# EAGLE design LedBoard (EAGLE 6.2)
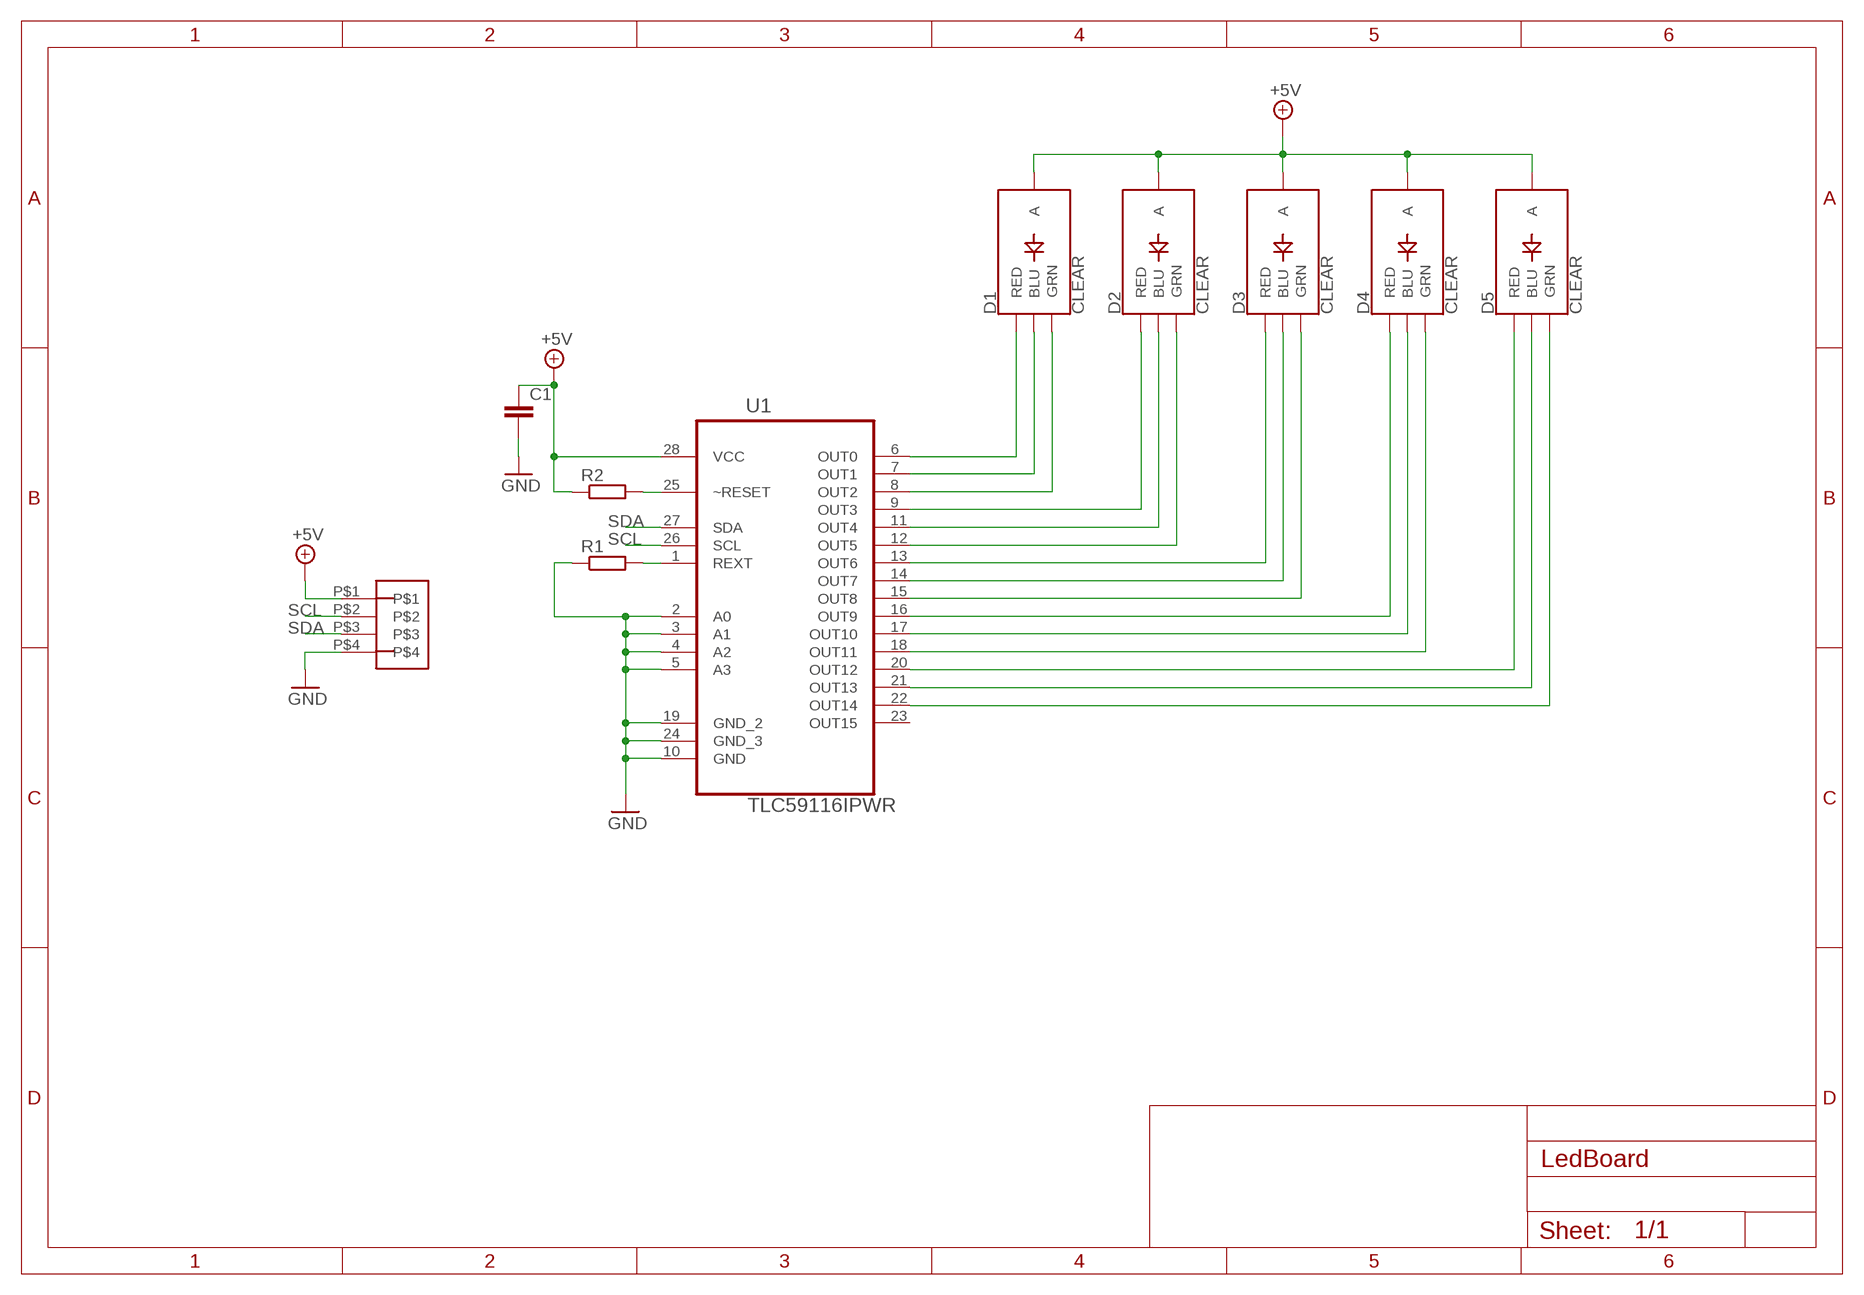
[diagram p0: schematic, sheet 1]

## Parts
C1  C-EUC0603  [C0603]
D1  CLEAR  LED-RGB-CACLEAR  [LED-RGB-THRU]
D2  CLEAR  LED-RGB-CACLEAR  [LED-RGB-THRU]
D3  CLEAR  LED-RGB-CACLEAR  [LED-RGB-THRU]
D4  CLEAR  LED-RGB-CACLEAR  [LED-RGB-THRU]
D5  CLEAR  LED-RGB-CACLEAR  [LED-RGB-THRU]
R1  R-EU_R0603  [R0603]
R2  R-EU_R0603  [R0603]
U1  TLC59116IPWR  [SOP65P640X120-28N]
U$1  4_PIN_JST-XH  [4_PIN_JST-XH]

## Nets
+5V: C1.1 D1.2(A) D2.2(A) D3.2(A) D4.2(A) D5.2(A) R2.1 U1.28(VCC) U$1.P$1
GND: C1.2 R1.1 U1.2(A0) U1.3(A1) U1.4(A2) U1.5(A3) U1.10(GND) U1.19(GND_2) U1.24(GND_3) U$1.P$4
N$1: D1.1(RED) U1.6(OUT0)
N$2: D1.4(BLU) U1.7(OUT1)
N$3: D1.3(GRN) U1.8(OUT2)
N$4: D2.1(RED) U1.9(OUT3)
N$5: D2.4(BLU) U1.11(OUT4)
N$6: D2.3(GRN) U1.12(OUT5)
N$7: D3.1(RED) U1.13(OUT6)
N$8: D3.4(BLU) U1.14(OUT7)
N$9: D3.3(GRN) U1.15(OUT8)
N$10: D4.1(RED) U1.16(OUT9)
N$11: D4.4(BLU) U1.17(OUT10)
N$12: D4.3(GRN) U1.18(OUT11)
N$13: D5.1(RED) U1.20(OUT12)
N$14: D5.4(BLU) U1.21(OUT13)
N$15: D5.3(GRN) U1.22(OUT14)
N$16: R1.2 U1.1(REXT)
N$20: R2.2 U1.25(~RESET)
SCL: U1.26(SCL) U$1.P$2
SDA: U1.27(SDA) U$1.P$3
Unconnected: U1.23(OUT15)

## Library data of the parts
C1 = rcl:C-EU: CAPACITOR, European symbol
D1-D5 = SparkFun-LED:LED-RGB-CA: LED-RGB Diffused Common Anode Packages: LED RGB-THRU P-LCC-4-3 LED-TRICOLOR-SMD SparkFun Products: RGB Diffused Common Anode- Diffuse <[https://www.sparkfun.com/products/10821]> RGB Diffused Common Anode - Clear <[https://www.sparkfun.com/products/10820]> Qduino Mini <[https://www.sparkfun.com/products/13614]> Triple Output LED RGB - SMD <https://www.sparkfun.com/products/7844>; PROD_ID: DIO-10631
R1 R2 = rcl:R-EU_: RESISTOR, European symbol
U1 = TLC59116IPWR:TLC59116IPWR: 16-CHANNEL Fm+ I2C-BUS CONSTANT-CURRENT LED SINK DRIVER; AVAILABILITY: Good; DESCRIPTION: 16-Bit Fast-Mode Plus (FM+) I2C Bus Constant-Current LED Sink Driver 28-TSSOP -40 to 85; MF: Texas Instruments; MP: TLC59116IPWR; PACKAGE: TSSOP-28 Texas Instruments; PRICE: 1.78 USD
U$1 = JST-XH_HEADERS:4_PIN_JST-XH

## Board
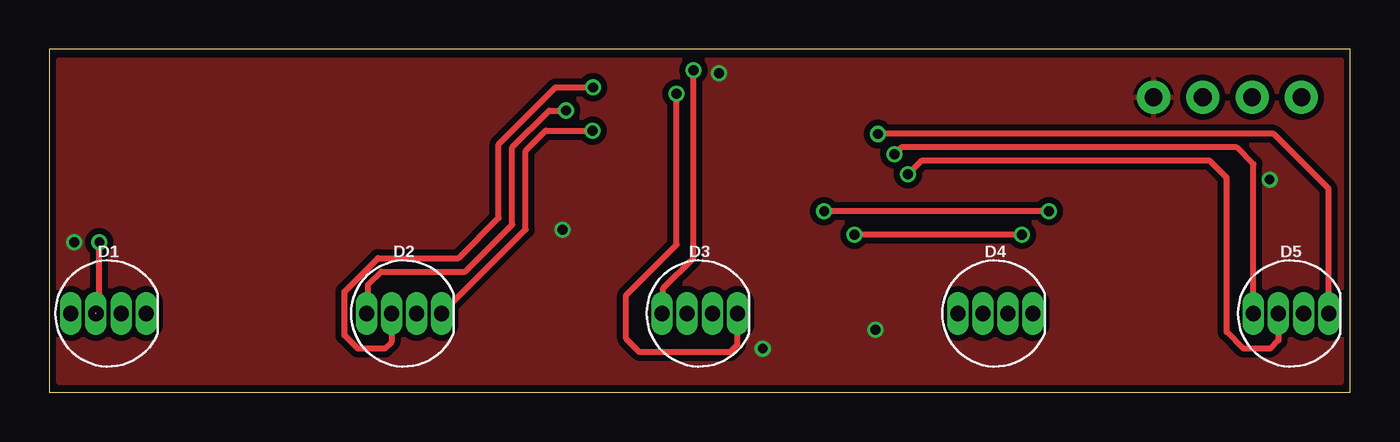
[diagram p1: board, top side]
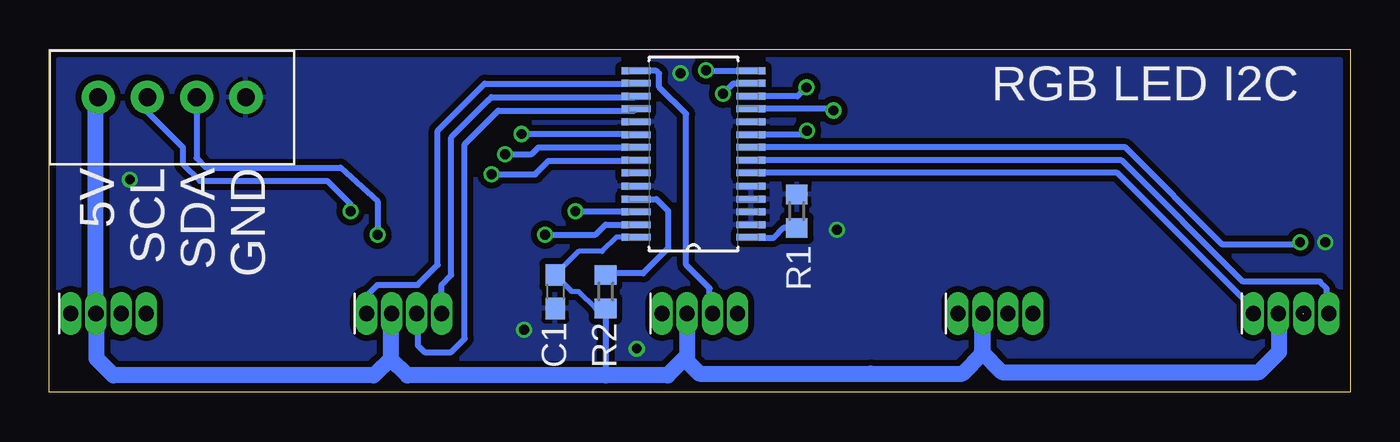
[diagram p2: board, bottom side, seen from below]

Size 66 x 17.4 mm. Coordinates in mm from the lower left corner, seen from the top.
Outline: 0,0 66,0 66,17.4 0,17.4 0,0
Copper layers (1*16): Top 0.018mm / dielectric 1.55mm / Bottom 0.018mm
Design rules: minimum track width 0.15mm, minimum drill 0.35mm, track to track 0.15mm, track to pad 0.15mm, pad to pad 0.15mm, via to via 0.15mm, smd to smd 0mil, copper to edge 0.25mm, drill to drill 0.35mm, minimum pad ring 0.1685mm, minimum via ring 0.125mm, stop-mask expansion 0mil, vias tented up to drill 0.45mm, thermal gap 0.2mm

### Footprints (pad centres in the part's own frame; a part is rotated, then mirrored left to right if it is on the bottom)
C0603 = smd 1.1 x 1: 1 -0.85,0; 2 0.85,0
LED-RGB-THRU = drill 0.762 pad 0.889 long: 1 1.905,0; 2 0.635,0; 3 -0.635,0; 4 -1.905,0
R0603 = smd 1 x 1.1: 1 -0.85,0; 2 0.85,0
SOP65P640X120-28N = smd 1.473 x 0.356: 1 -2.921,4.216; 2 -2.921,3.581; 3 -2.921,2.921; 4 -2.921,2.286; 5 -2.921,1.626; 6 -2.921,0.965; 7 -2.921,0.33; 8 -2.921,-0.33; 9 -2.921,-0.965; 10 -2.921,-1.626; 11 -2.921,-2.286; 12 -2.921,-2.921; 13 -2.921,-3.581; 14 -2.921,-4.216; 15 2.921,-4.216; 16 2.921,-3.581; 17 2.921,-2.921; 18 2.921,-2.286; 19 2.921,-1.626; 20 2.921,-0.965; 21 2.921,-0.33; 22 2.921,0.33; 23 2.921,0.965; 24 2.921,1.626; 25 2.921,2.286; 26 2.921,2.921; 27 2.921,3.581; 28 2.921,4.216
4_PIN_JST-XH = drill 0.9 pad 1.676: P$1 2.45,3.4; P$2 4.95,3.4; P$3 7.45,3.4; P$4 9.95,3.4

### Placement (x,y rotation side)
C1  40.33,5.11 270 bottom
D1  3,4 0 top
D2  18,4 0 top
D3  33,4 0 top
D4  48,4 0 top
D5  63,4 0 top
R1  28.08,9.19 270 bottom
R2  37.78,5.11 90 bottom
U1  33.32,12.09 180 bottom
U$1  65.98,11.57 0 bottom

### Tracks (layer width: path | path; a pad name or v marks a point on that pad's centre or on a via)
+5V
  Bottom 0.254: U1.28 37.22,7.88 37.95,7.15 39.14,7.15 C1.1 39.48,5.11 39.14,5.11 38.29,4.25 R2.1
  Bottom 0.305: 24.16,1.12 24.34,0.95 | R2.1 37.78,0.86
  Bottom 0.813: D1.2 3.6,3.96 3.6,2.06 4.63,1.03 17.66,1.03 18.69,2.06 18.69,3.95 D2.2 18.64,2 19.68,0.95 24.34,0.95 33.02,0.95 33.66,1.59 33.66,3.98 D3.2 33.63,1.85 34.63,0.86 37.78,0.86 47.84,0.86 48.69,1.71 | D4.2 48.69,3.94 48.69,1.71 | 48.69,1.71 49.55,0.86 62.75,0.86 63.61,1.71 63.61,3.97 D5.2 63.63,14.87 U$1.P$1
GND  (via drill 0.5 pad 0.81)
  other vias: 1.27,7.62 33.97,16.19 41.91,3.17 36.2,2.22 26.04,8.26 61.91,10.79
  pour Bottom (isolate 0.305): 0.49,16.87 65.54,16.87 65.54,0.49 0.49,0.49
  pour Top (isolate 0.305): 0.49,16.87 65.54,16.87 65.54,0.49 0.49,0.49
N$1
  Bottom 0.305: D1.1 4.93,4.03 4.93,4.25 11.81,11.13 U1.6
N$2
  Bottom 0.305: D1.4 1.19,4.1 1.19,5.28 1.53,5.62 5.45,5.62 11.59,11.76 U1.7
N$3  (via drill 0.5 pad 0.81)  (1 unrouted)
  Top 0.305: 2.38,3.98 2.54,4.14 v2.54,7.62
  Bottom 0.305: U1.8 11.4,12.42 6.47,7.5 2.66,7.5 v2.54,7.62
N$4  (via drill 0.5 pad 0.81)
  Top 0.305: D2.1 24.17,8.26 24.17,12.25 25.19,13.27 v27.57,13.27
  Bottom 0.305: v27.57,13.27 27.79,13.06 U1.9
N$5  (via drill 0.5 pad 0.81)
  Top 0.305: D2.4 16.17,4.07 16.17,5.45 16.85,6.13 21.1,6.13 23.48,8.51 23.48,12.42 25.36,14.29 v26.21,14.29
  Bottom 0.305: v26.21,14.29 26.29,14.38 U1.11
N$6  (via drill 0.5 pad 0.81)
  Top 0.305: D2.3 17.36,2.55 17.02,2.21 15.66,2.21 14.98,2.89 14.98,5.11 16.68,6.81 20.76,6.81 22.8,8.85 22.8,12.59 25.67,15.46 v27.59,15.46
  Bottom 0.305: v27.59,15.46 28.04,15.01 U1.12
N$7  (via drill 0.5 pad 0.81)
  Top 0.305: D3.1 34.89,3.98 34.89,2.38 34.55,2.04 29.95,2.04 29.27,2.72 29.27,4.93 31.82,7.49 v31.82,15.15
  Bottom 0.305: v31.82,15.15 31.3,15.67 U1.13
N$8  (via drill 0.5 pad 0.81)
  Top 0.305: D3.4 31.14,4.05 31.14,5.28 32.67,6.81 v32.67,16.34
  Bottom 0.305: v32.67,16.34 32.65,16.31 U1.14
N$9
  Bottom 0.305: D3.3 32.5,4.14 32.5,5.28 33.7,6.47 33.7,14.12 35.06,15.49 35.06,16.17 35.2,16.31 U1.15
N$10
  Bottom 0.305: D4.1 49.91,4.89 49.35,5.45 47.31,5.45 46.29,6.47 46.29,13.27 43.91,15.66 36.25,15.66 U1.16
N$11
  Bottom 0.305: D4.4 46.09,5.47 45.61,5.96 45.61,12.93 43.74,14.81 | 43.74,14.81 | 43.74,14.81 43.57,14.98 36.27,14.98 U1.17
N$12
  Bottom 0.305: D4.3 47.31,3.94 47.31,2.38 46.97,2.04 45.61,2.04 44.93,2.72 44.93,12.59 43.23,14.29 36.32,14.29 U1.18
N$13  (via drill 0.5 pad 0.81)
  Top 0.305: D5.1 64.91,10.31 62.12,13.1 v42.03,13.1
  Bottom 0.305: v42.03,13.1 36.29,13.1 U1.20
N$14  (via drill 0.5 pad 0.81)
  Top 0.305: D5.4 61.09,11.57 60.24,12.42 43.23,12.42 v42.88,12.08
  Bottom 0.305: v42.88,12.08 41.52,12.08 41.18,12.42 U1.21
N$15  (via drill 0.5 pad 0.81)
  Top 0.305: D5.3 62.37,2.63 61.95,2.21 60.58,2.21 59.73,3.06 59.73,10.89 58.88,11.74 44.25,11.74 v43.57,11.06
  Bottom 0.305: v43.57,11.06 41.35,11.06 40.67,11.74 36.26,11.74 U1.22
N$16
  Bottom 0.305: R1.2 28.76,8.34 29.27,7.83 30.35,7.83 U1.1
N$20
  Bottom 0.305: U1.25 35.2,9.8 34.61,9.21 34.61,7.3 35.88,6.03 37.7,6.03 R2.2
SCL  (via drill 0.5 pad 0.81)
  Top 0.305: v50.71,9.19 v39.31,9.19
  Bottom 0.305: U$1.P$2 61.03,14.23 60.24,13.44 59.22,12.42 59.22,11.57 58.37,10.72 51.91,10.72 50.71,9.53 v50.71,9.19 | v39.31,9.19 36.26,9.19 U1.26
SDA  (via drill 0.5 pad 0.81)
  Top 0.305: v49.35,8 v40.84,8
  Bottom 0.305: U$1.P$3 58.53,11.9 58.03,11.4 51.22,11.4 49.35,9.7 v49.35,8 | v40.84,8 38.29,8 37.78,8.51 U1.27

### Text on the board
bNames: RGB LED I2C | GND | SDA | SCL | 5V